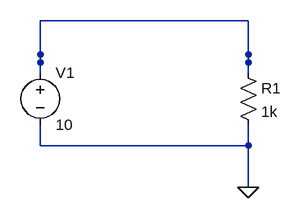
[diagram p0: schematic bomb_editor.asc]
bomb_editor.asc, the LTspice schematic file:
Version 4
SHEET 1 880 680
WIRE 832 400 832 372
WIRE 832 512 832 480
SYMBOL res 816 384 R0
SYMATTR InstName R1
SYMATTR Value 1k
FLAG 832 576 0
WIRE 512 400 512 372
WIRE 512 512 512 480
SYMBOL voltage 512 384 R0
SYMATTR InstName V1
SYMATTR Value 10
WIRE 768 320 832 320
WIRE 832 320 832 384
WIRE 768 512 832 512
WIRE 832 512 832 576
WIRE 512 320 576 320
WIRE 512 320 512 384
WIRE 512 512 576 512
WIRE 704 512 768 512
WIRE 704 320 768 320
WIRE 640 320 704 320
WIRE 576 320 640 320
WIRE 640 512 704 512
WIRE 576 512 640 512

The netlist it stands for:
* bomb_editor.asc
R1 N001 0 1k
V1 N001 0 10
.backanno
.end